# Altium schematic sheet Sheet3.SchDoc
size A4; SheetNumber: 4; SheetTotal: 4
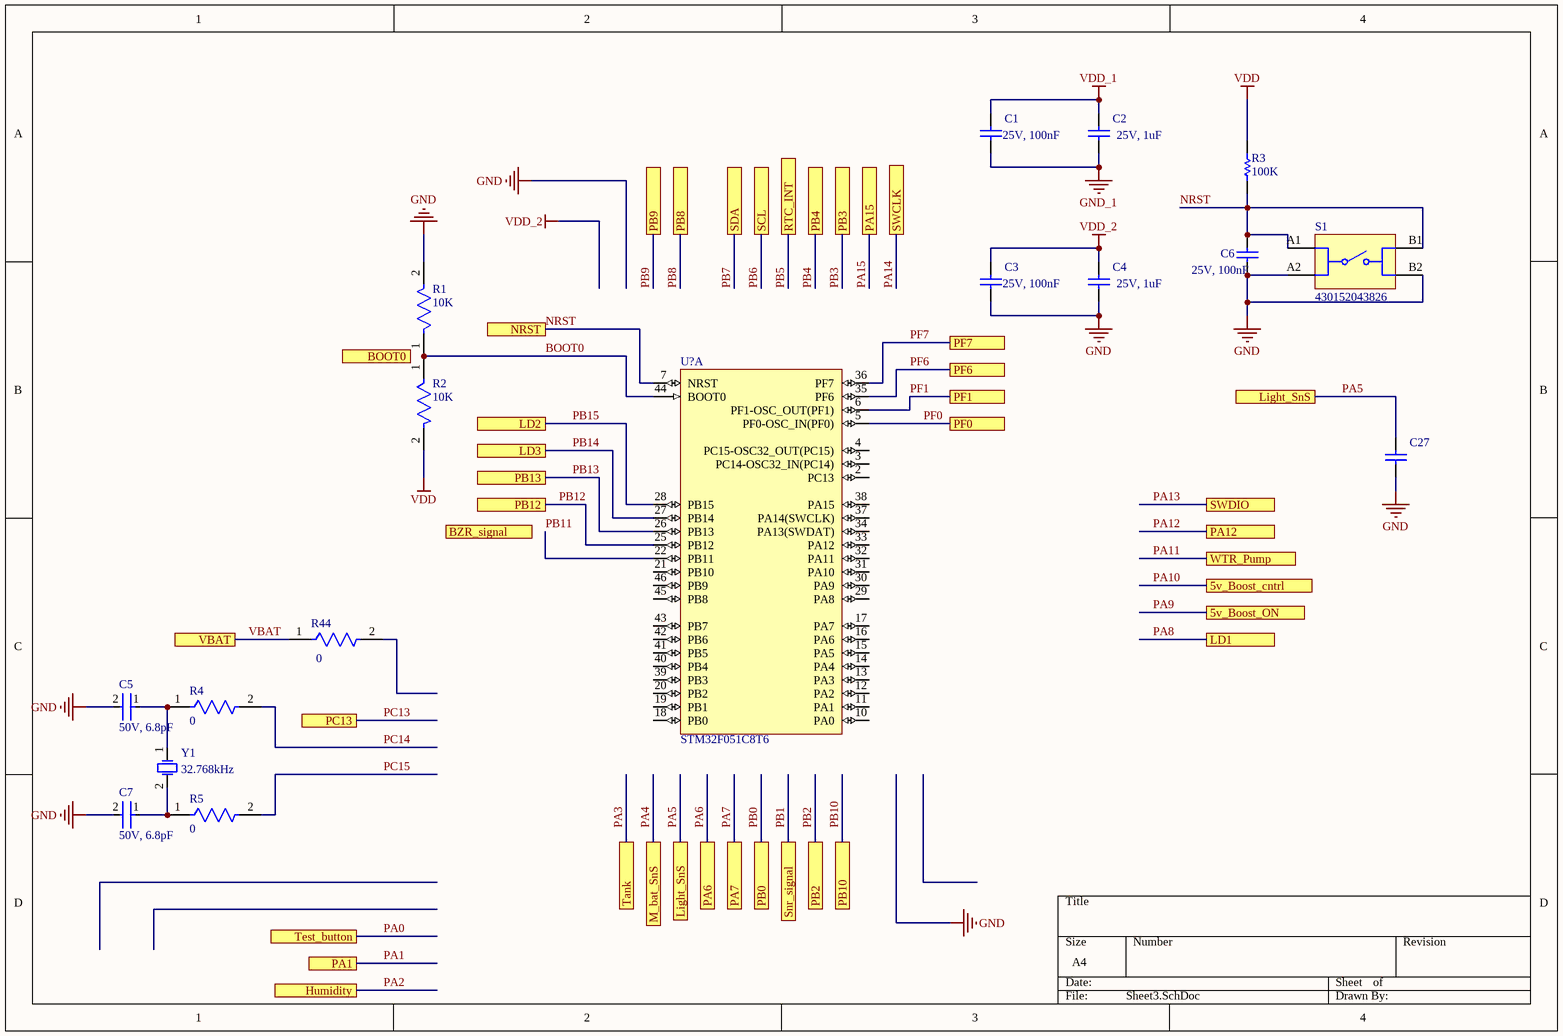
[diagram p0: Sheet3.SchDoc]

## Parts
C1  25V, 100nF  [WCAP-CSGP_0402_L1W0.5H0.5]
C2  25V, 1uF  [WCAP-CSGP_0603_L1.6W0.8H0.8_Reflow]
C3  25V, 100nF  [WCAP-CSGP_0402_L1W0.5H0.5]
C4  25V, 1uF  [WCAP-CSGP_0603_L1.6W0.8H0.8_Reflow]
C5  50V, 6.8pF  [FP-GCM155-0_05-IPC_B]
C6  25V, 100nF  [WCAP-CSGP_0402_L1W0.5H0.5]
C7  50V, 6.8pF  [FP-GCM155-0_05-IPC_B]
C27  885012206052  [WCAP-CSGP_0603_L1.6W0.8H0.8_Reflow]  (value not drawn)
R1  10K  [FP-AC0603-IPC_A]
R2  10K  [FP-AC0603-IPC_A]
R3  100K  [RESC0603(1608)_N]
R4  0  [FP-WSL0603-9-MFG]
R5  0  [FP-WSL0603-9-MFG]
R44  0  [FP-WSL0603-9-MFG]
S1  430152043826  [430152043826]
U?  STM32F051C8T6  [STM-LQFP48_N]  (part A of 2)
Y1  32.768kHz  [WE-XTAL_CFPX-56]

## Ports
5v_Boost_cntrl (see Sheet1[3C]), 5v_Boost_ON (see Sheet1[2C]), BOOT0, BZR_signal (see Sheet1[2A]), Humidity (see Sheet2[2C]), LD1 (see Sheet2[2C]), LD2 (see Sheet2[2C]), LD3 (see Sheet2[2D]), Light_SnS (see Sheet2[3C], Sheet3[2D]), Light_SnS (see Sheet2[3C], Sheet3[4B]), M_bat_SnS (see Sheet1[4C]), NRST (see Sheet2[4C]), PA1, PA6, PA7, PA12, PA15, PB0, PB2, PB3, PB4, PB8, PB9, PB10, PB12, PB13, PC13, PF0, PF1, PF6, PF7, RTC_INT (see Sheet2[2B]), SCL (see Sheet2[1B]), SDA (see Sheet2[1B]), Snr_signal (see Sheet2[1C], Sheet2[2A]), SWCLK (see Sheet2[4C]), SWDIO (see Sheet2[3C]), Tank (see Sheet2[4A]), Test_button (see Sheet2[3C]), VBAT (see Sheet2[1B]), WTR_Pump (see Sheet1[3A])

## Nets
GND: C3.2 C4.2 C5.2 C6.1 C7.2 C27.1 R1.2 S1.A2 S1.B2
GND_1: C1.2 C2.2
VDD: R2.2 R3.2
VDD_1: C1.1 C2.1
VDD_2: C3.1 C4.1
BOOT0: R1.1 R2.1 U?.44(BOOT0)
NRST: C6.2 R3.1 S1.A1 S1.B1 U?.7(NRST) ; port NRST
PA0: port Test_button
PA1: port PA1
PA2: port Humidity
PA3: port Tank
PA4: port M_bat_SnS
PA5: C27.2 ; port Light_SnS
PA6: port PA6
PA7: port PA7
PA8: port LD1
PA9: port 5v_Boost_ON
PA10: port 5v_Boost_cntrl
PA11: port WTR_Pump
PA12: port PA12
PA13: port SWDIO
PA14: port SWCLK
PA15: port PA15
PB0: port PB0
PB1: port Snr_signal
PB2: port PB2
PB3: port PB3
PB4: port PB4
PB5: port RTC_INT
PB6: port SCL
PB7: port SDA
PB8: port PB8
PB9: port PB9
PB10: port PB10
PB11: U?.22(PB11)
PB12: U?.25(PB12) ; port PB12
PB13: U?.26(PB13) ; port PB13
PB14: U?.27(PB14) ; port LD3
PB15: U?.28(PB15) ; port LD2
PC13: port PC13
PC14: R4.2
PC15: R5.2
PF0: U?.5(PF0-OSC_IN(PF0)) ; port PF0
PF1: U?.6(PF1-OSC_OUT(PF1)) ; port PF1
PF6: U?.35(PF6) ; port PF6
PF7: U?.36(PF7) ; port PF7
VBAT: R44.1 ; port VBAT
NetC5_1: C5.1 R4.1 Y1.1(OSC1)
NetC7_1: C7.1 R5.1 Y1.2(OSC2)

Not connected (* = marked no-connect by the designer): R44 2; U? 2(PC13) 3(PC14-OSC32_IN(PC14)) 4(PC15-OSC32_OUT(PC15)) 10(PA0) 11(PA1) 12(PA2) 13(PA3) 14(PA4) 15(PA5) 16(PA6) 17(PA7) 18(PB0) 19(PB1) 20(PB2) 21(PB10) 29(PA8) 30(PA9) 31(PA10) 32(PA11) 33(PA12) 34(PA13(SWDAT)) 37(PA14(SWCLK)) 38(PA15) 39(PB3) 40(PB4) 41(PB5) 42(PB6) 43(PB7) 45(PB8) 46(PB9)

## Library data of the parts
C1 C3 C6 = CMP-03913-53703139-2: Ceramic Capacitor, Multilayer, Ceramic, 25V, 20% +Tol, 20% -Tol, X5R, 15% TC, 0.1uF, Surface Mount, 0402; Insulation Resistance: 5GΩ; Min Operating Temperature: -55°C; Capacitance: 100nF; REACH SVHC: Unknown; Voltage Rating (DC): 25V; Material: Ceramic; Width: 500µm; Mount: Surface Mount; RoHS: Compliant; Dielectric: X5R; Max Operating Temperature: 85°C; Length: 1mm; Case/Package: 0402; Voltage Rating: 25V; Thickness: 558.8µm; Tolerance: 20%; Case Code (Metric): 1005; Height: 500µm; Case Code (Imperial): 0402
C2 C4 = CMP-03913-53758747-2: Ceramic Capacitor, Multilayer, Ceramic, 25V, 20% +Tol, 20% -Tol, X5R, 15% TC, 1uF, Surface Mount, 0603; Capacitance: 1µF; Insulation Resistance: 500MΩ; Height: 800µm; Width: 800µm; Case Code (Imperial): 0603; Mount: Surface Mount; Max Operating Temperature: 85°C; Voltage Rating: 25V; Thickness: 939.8µm; Min Operating Temperature: -55°C; Case Code (Metric): 1608; Tolerance: 20%; REACH SVHC: Unknown; RoHS: Compliant; Dielectric: X5R; Voltage Rating (DC): 25V; Case/Package: 0603; Length: 1.6mm
C5 C7 = CMP-06035-021449-1: Ceramic Capacitor for Automotive 6.8pF ±0.1pF 50VDC C0G 0402 Paper T/R
C27 = CMP-03913-53914761-2: Capacitor, 1UF Multilayer Ceramic Mlcc 16 V , X7R Dielectric 0603 Surface Mount; Insulation Resistance: 100MΩ; Voltage Rating: 16V; Capacitance: 1µF; Tolerance: 10%; REACH SVHC: Unknown; Thickness: 939.8µm; Material: Ceramic; Length: 1.6mm; Voltage Rating (DC): 16V; RoHS: Compliant; Min Operating Temperature: -55°C; Case Code (Imperial): 0603; Height: 800µm; Case/Package: 0603; Mount: Surface Mount; Case Code (Metric): 1608; Max Operating Temperature: 125°C; Width: 800µm; Dielectric: X7R
R1 R2 = CMP-03412-040683-1: RES 10kΩ 5.00% 0.2W 0603
R3 = CMP-1012-00122-1: 100K 0.1W 5% 0603 (1608 Metric)  SMD; Case-EIA: 0603; Value: 100000.00 Ohm; Case-Metric: 1608; Tolerance: 5 %; Power: 0.1 W; Technology: SMT
R4 R5 R44 = CMP-02407-013151-1: RES 0 OHM JUMPER 0603; Temperature Coefficient: 3900ppm/°C; Resistance: 0R; Packaging: Cut Tape; Max Operating Temperature: 170°C; Series: WSL; Contact Plating: Tin; Case Code (Imperial): 0603; Resistor Type: Metal Strip; Number of Terminations: 2; Min Operating Temperature: -65°C; RoHS Compliant: Yes; Case Code (Metric): 1608; Case/Package: 0603
S1 = CMP-1452-00001-5: Switch Tactile Spst-no 0.05A 12V; Manufacturer Lifecycle Status: ACTIVE; Insulation Resistance: 100MΩ; YEOL: 1 = Estimated lifetime > 10 years; Current Rating: 50mA; RoHS: Compliant; Color: White; Max Operating Temperature: 85°C; Height: 4.3mm; Packaging: Tape and Reel; Diameter: 3.5mm; Contact Current Rating: 50mA; Voltage Rating: 12V; Lifecycle Status: Production; Min Operating Temperature: -40°C; Contact Plating: Silver
U? = CMP-0304-00010-3: ARM Cortex-M0 32-bit MCU, 64 KB Flash, 8 KB Internal RAM, 39 I/Os, 48-pin LQFP, -40 to 85 degC, Tray; Internal RAM Size (kB): 8; I/Os (High Current): 39; Supply Voltage(Vcc) min (V): 2; FLASH Size (Prog) (kB): 64; Operating Frequency(F) (Processor speed) (MHz): 48; Packing: Tray; Core: ARM Cortex-M0; PartNumber: STM32F051C8T6; DatasheetVersion: Rev. 3; PackageVersion: Rev. 6, 06/2013; PackageReference: LQFP48; PackageDescription: 48-Pin Low Profile Quad Flat Package, 7 x 7 mm Body, 0.5 mm Pitch; Mounting Technology: Surface Mount; ComponentLink1Description: Manufacturer URL; ComponentLink3URL: http://www.st.com/st-web-ui/static/active/en/resource/technical/document/datasheet/DM00058181.pdf; ComponentLink1URL: http://www.st.com/web/en/home.html; ComponentLink2Description: Datasheet; ComponentLink3Description: Package Specification; ComponentLink2URL: http://www.st.com/st-web-ui/static/active/en/resource/technical/document/datasheet/DM00039193.pdf
Y1 = CMP-207858-000007-3: WE-XTAL Quartz Crystal; Tolerance: 0.002%; Load Capacitance: 12.5pF; ESR (Equivalent Series Resistance): 40kΩ; Max Operating Temperature: 85°C; Width: 2.54mm; Height: 2.54mm; Min Operating Temperature: -40°C; Length: 9.5mm; RoHS: Compliant; Frequency: 32.768kHz